# Altium schematic sheet NRF24L01_SPI#5.SchDoc
size A4; DocumentNumber: 2; SheetNumber: 2; SheetTotal: 2
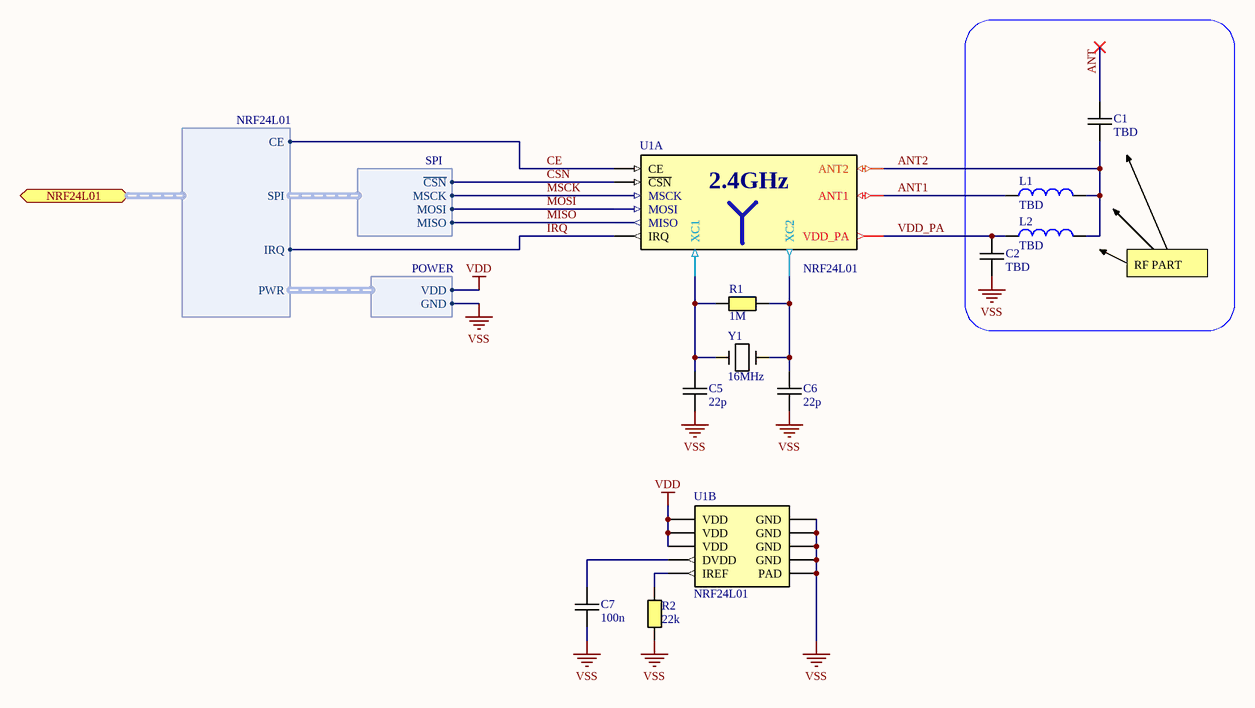
[diagram p0: NRF24L01_SPI#5.SchDoc]

## Parts
C1  TBD  [CAPC0603(1608)55_N]
C2  TBD  [CAPC0603(1608)55_N]
C5  22p  [CAPC0603(1608)55_L]
C6  22p  [CAPC0603(1608)55_L]
C7  100n  [CAPC0603(1608)55_L]
L1  TBD  [C_0603]
L2  TBD  [C_0603]
R1  1M  [RESC0603(1608)_N]
R2  22k  [RESC0603(1608)_N]
U1  NRF24L01  [QFN20]  (parts A,B of 2)
Y1  16MHz  [3225]

## Ports
NRF24L01 (harness NRF24L01)

## Harnesses
SPI: ~{CSN}, MSCK, MOSI, MISO
NRF24L01: SPI, CE, IRQ, PWR
POWER: VDD, GND

## Nets
GND: Y1.2 Y1.4
VDD: U1.7(VDD) U1.15(VDD) U1.18(VDD) ; harness POWER.VDD
VSS: C2.2 C5.2 C6.2 C7.2 R2.2 U1.8(GND) U1.14(GND) U1.17(GND) U1.20(GND) U1.21(PAD) ; harness POWER.GND
ANT: C1.1
ANT1: L1.1 U1.12(ANT1)
ANT2: C1.2 L1.2 L2.2 U1.13(ANT2)
~{CSN}: U1.2(~{CSN}) ; harness SPI.~{CSN}
CE: U1.1(CE) ; port NRF24L01.CE
IRQ: U1.6(IRQ) ; port NRF24L01.IRQ
MISO: U1.5(MISO) ; harness SPI.MISO
MOSI: U1.4(MOSI) ; harness SPI.MOSI
MSCK: U1.3(MSCK) ; harness SPI.MSCK
VDD_PA: C2.1 L2.1 U1.11(VDD_PA)
NetC5_1: C5.1 R1.1 U1.10(XC1) Y1.1
NetC6_1: C6.1 R1.2 U1.9(XC2) Y1.3
NetC7_1: C7.1 U1.19(DVDD)
NetR2_1: R2.1 U1.16(IREF)

## Notes on the sheet
- RF PART
- (in symbol NRF24L01, part A) 2.4GHz

## Library data of the parts
C1 C2 = Capacitor M: Ceramic capacitor Medium density; Value: TBD
C5-C7 = Capacitor H: Ceramic capacitor High density
  C5 C6: Value: 22p
  C7: Value: 100n
L1 L2 = Inductor: Value: TBD
R1 R2 = Resistor M: Resistor Medium Density
  R1: Value: 1M
  R2: Value: 22k
U1 = NRF24L01: 2.4GHz WIRELESS TRANSIVER
Y1 = CRYSTAL: Value: 16MHz